# EAGLE design AVRI2CIO_V0_2 (EAGLE 6.3)
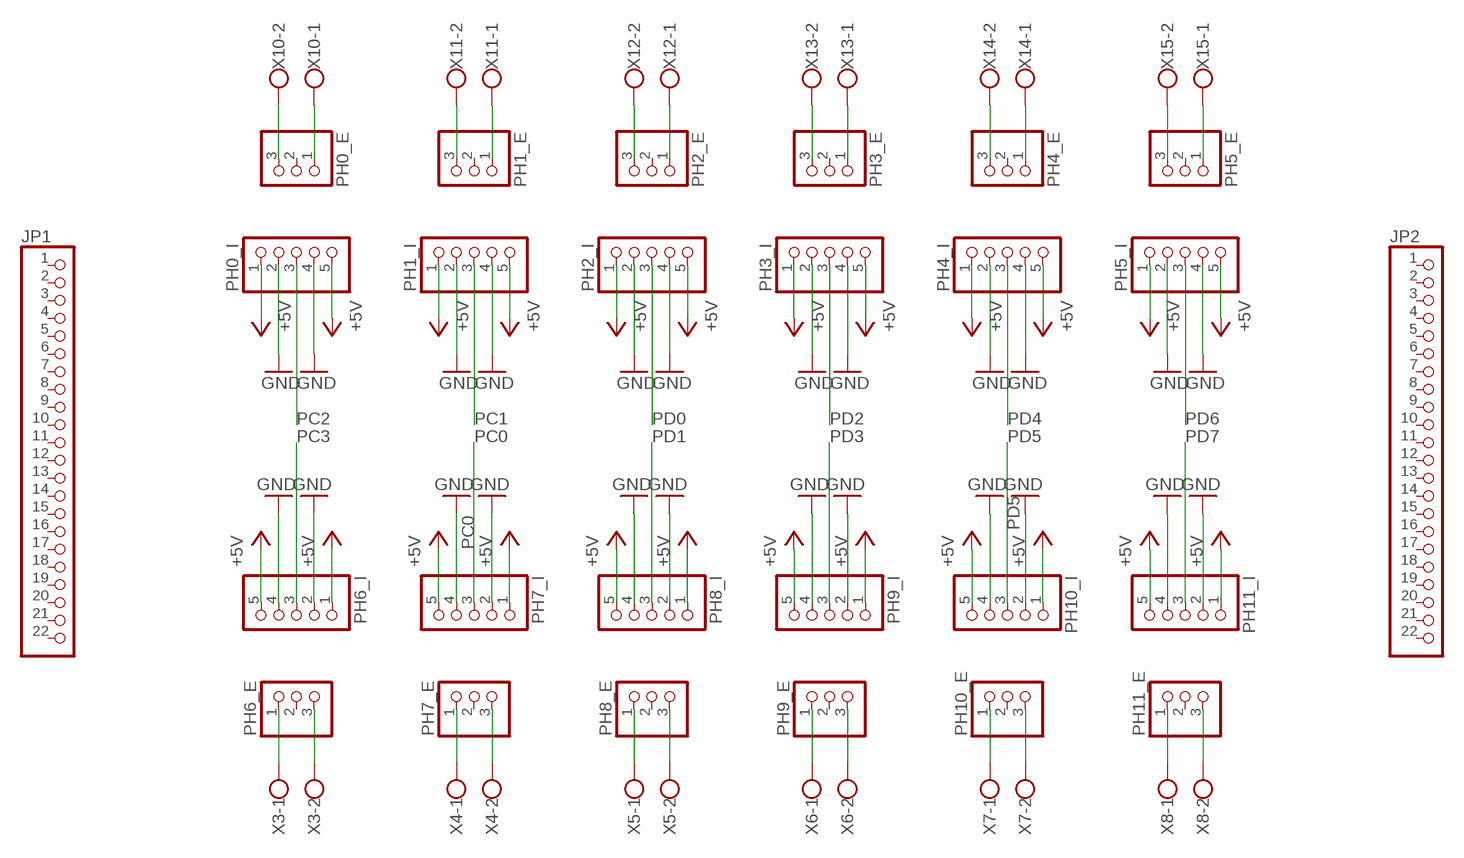
[diagram p0: schematic, sheet 1]

## Parts
JP1  PINHD-1X22  [1X22]
JP2  PINHD-1X22  [1X22]
PH0_E  PINHD-1X3  [1X03]
PH0_I  PINHD-1X5  [1X05]
PH1_E  PINHD-1X3  [1X03]
PH1_I  PINHD-1X5  [1X05]
PH2_E  PINHD-1X3  [1X03]
PH2_I  PINHD-1X5  [1X05]
PH3_E  PINHD-1X3  [1X03]
PH3_I  PINHD-1X5  [1X05]
PH4_E  PINHD-1X3  [1X03]
PH4_I  PINHD-1X5  [1X05]
PH5_E  PINHD-1X3  [1X03]
PH5_I  PINHD-1X5  [1X05]
PH6_E  PINHD-1X3  [1X03]
PH6_I  PINHD-1X5  [1X05]
PH7_E  PINHD-1X3  [1X03]
PH7_I  PINHD-1X5  [1X05]
PH8_E  PINHD-1X3  [1X03]
PH8_I  PINHD-1X5  [1X05]
PH9_E  PINHD-1X3  [1X03]
PH9_I  PINHD-1X5  [1X05]
PH10_E  PINHD-1X3  [1X03]
PH10_I  PINHD-1X5  [1X05]
PH11_E  PINHD-1X3  [1X03]
PH11_I  PINHD-1X5  [1X05]
X3  W237-102  [W237-102]
X4  W237-102  [W237-102]
X5  W237-102  [W237-102]
X6  W237-102  [W237-102]
X7  W237-102  [W237-102]
X8  W237-102  [W237-102]
X10  W237-102  [W237-102]
X11  W237-102  [W237-102]
X12  W237-102  [W237-102]
X13  W237-102  [W237-102]
X14  W237-102  [W237-102]
X15  W237-102  [W237-102]

## Nets
+5V: PH0_I.1 PH0_I.5 PH1_I.1 PH1_I.5 PH2_I.1 PH2_I.5 PH3_I.1 PH3_I.5 PH4_I.1 PH4_I.5 PH5_I.1 PH5_I.5 PH6_I.1 PH6_I.5 PH7_I.1 PH7_I.5 PH8_I.1 PH8_I.5 PH9_I.1 PH9_I.5 PH10_I.1 PH10_I.5 PH11_I.1 PH11_I.5
GND: PH0_I.2 PH0_I.4 PH1_I.2 PH1_I.4 PH2_I.2 PH2_I.4 PH3_I.2 PH3_I.4 PH4_I.2 PH4_I.4 PH5_I.2 PH5_I.4 PH6_I.2 PH6_I.4 PH7_I.2 PH7_I.4 PH8_I.2 PH8_I.4 PH9_I.2 PH9_I.4 PH10_I.2 PH10_I.4 PH11_I.2 PH11_I.4
N$1: PH0_E.3 X10.2
N$2: PH0_E.1 X10.1
N$3: PH6_E.3 X3.2
N$4: PH6_E.1 X3.1
N$5: PH7_E.3 X4.2
N$6: PH7_E.1 X4.1
N$7: PH8_E.3 X5.2
N$8: PH8_E.1 X5.1
N$9: PH9_E.3 X6.2
N$10: PH9_E.1 X6.1
N$11: PH10_E.3 X7.2
N$12: PH10_E.1 X7.1
N$13: PH11_E.3 X8.2
N$14: PH11_E.1 X8.1
N$19: PH1_E.1 X11.1
N$20: PH1_E.3 X11.2
N$23: PH2_E.1 X12.1
N$24: PH2_E.3 X12.2
N$25: PH3_E.1 X13.1
N$26: PH3_E.3 X13.2
N$27: PH4_E.1 X14.1
N$28: PH4_E.3 X14.2
N$29: PH5_E.1 X15.1
N$30: PH5_E.3 X15.2
PC0: PH7_I.3
PC1: PH1_I.3
PC2: PH0_I.3
PC3: PH6_I.3
PD0: PH2_I.3
PD1: PH8_I.3
PD2: PH3_I.3
PD3: PH9_I.3
PD4: PH4_I.3
PD5: PH10_I.3
PD6: PH5_I.3
PD7: PH11_I.3
Unconnected: JP1.1 JP1.2 JP1.3 JP1.4 JP1.5 JP1.6 JP1.7 JP1.8 JP1.9 JP1.10 JP1.11 JP1.12 JP1.13 JP1.14 JP1.15 JP1.16 JP1.17 JP1.18 JP1.19 JP1.20 JP1.21 JP1.22 JP2.1 JP2.2 JP2.3 JP2.4 JP2.5 JP2.6 JP2.7 JP2.8 JP2.9 JP2.10 JP2.11 JP2.12 JP2.13 JP2.14 JP2.15 JP2.16 JP2.17 JP2.18 JP2.19 JP2.20 JP2.21 JP2.22 PH0_E.2 PH1_E.2 PH2_E.2 PH3_E.2 PH4_E.2 PH5_E.2 PH6_E.2 PH7_E.2 PH8_E.2 PH9_E.2 PH10_E.2 PH11_E.2

## Library data of the parts
JP1 JP2 = pinhead:PINHD-1X22: PIN HEADER
PH0_E PH1_E PH2_E PH3_E PH4_E PH5_E PH6_E PH7_E PH8_E PH9_E PH10_E PH11_E = pinhead:PINHD-1X3: PIN HEADER
PH0_I PH1_I PH2_I PH3_I PH4_I PH5_I PH6_I PH7_I PH8_I PH9_I PH10_I PH11_I = pinhead:PINHD-1X5: PIN HEADER
X3-X8 X10-X15 = con-wago-500:W237-102: WAGO SCREW CLAMP; MPN: 237-102; OC_FARNELL: unknown; OC_NEWARK: 70K9898

## Board
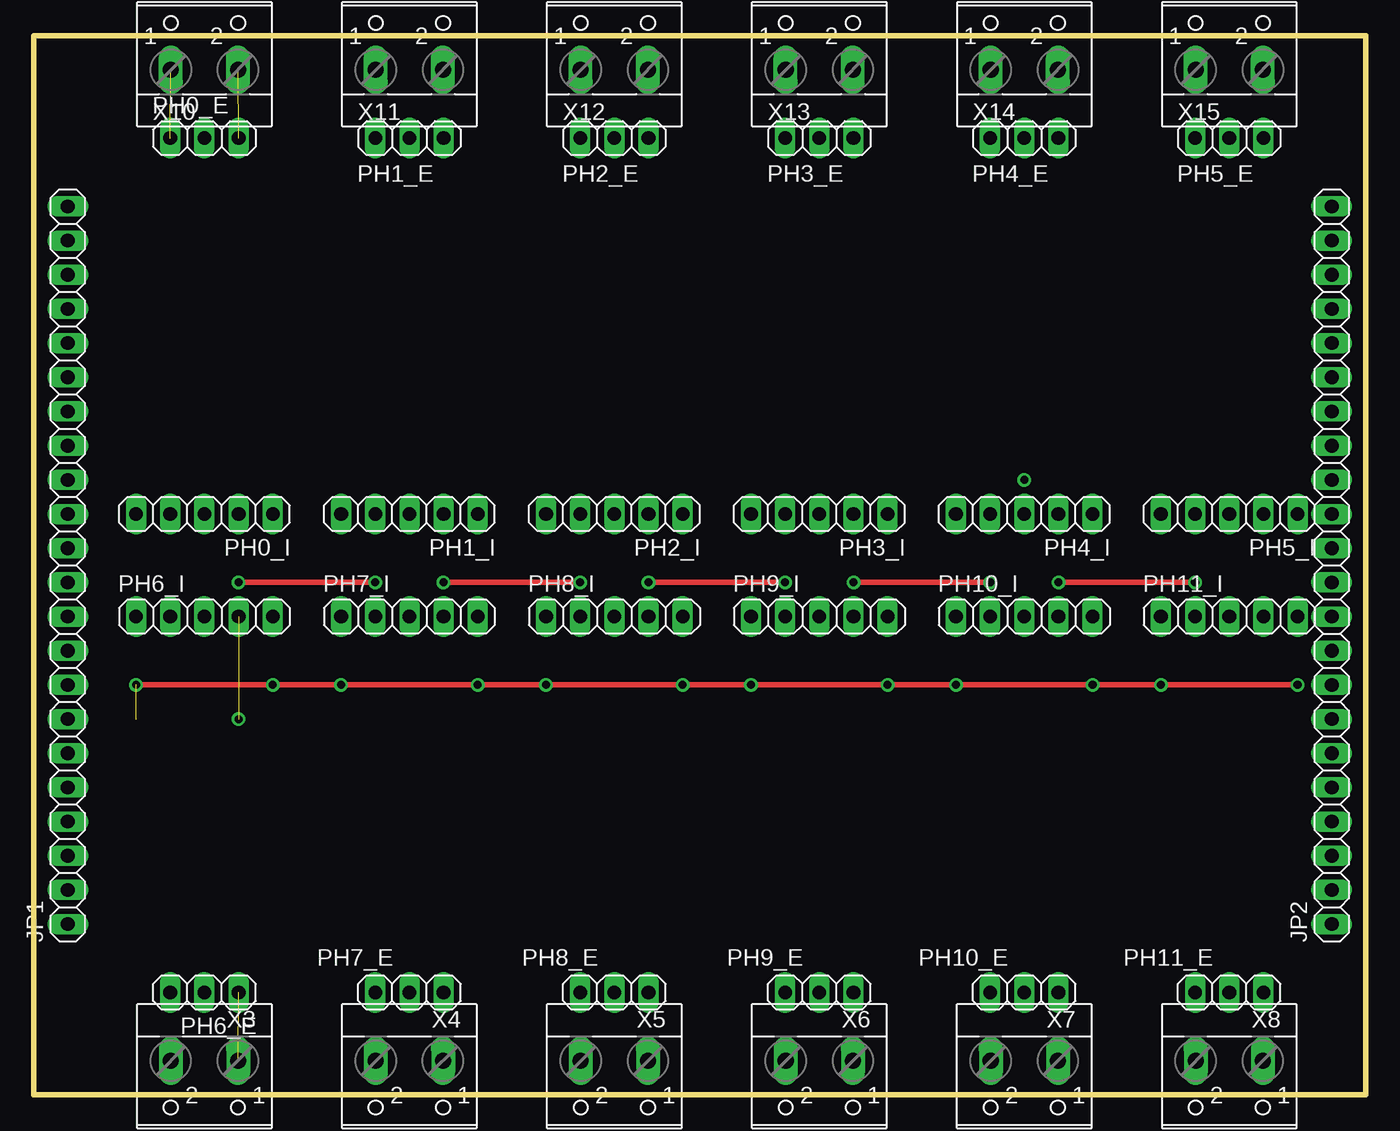
[diagram p1: board, top side]
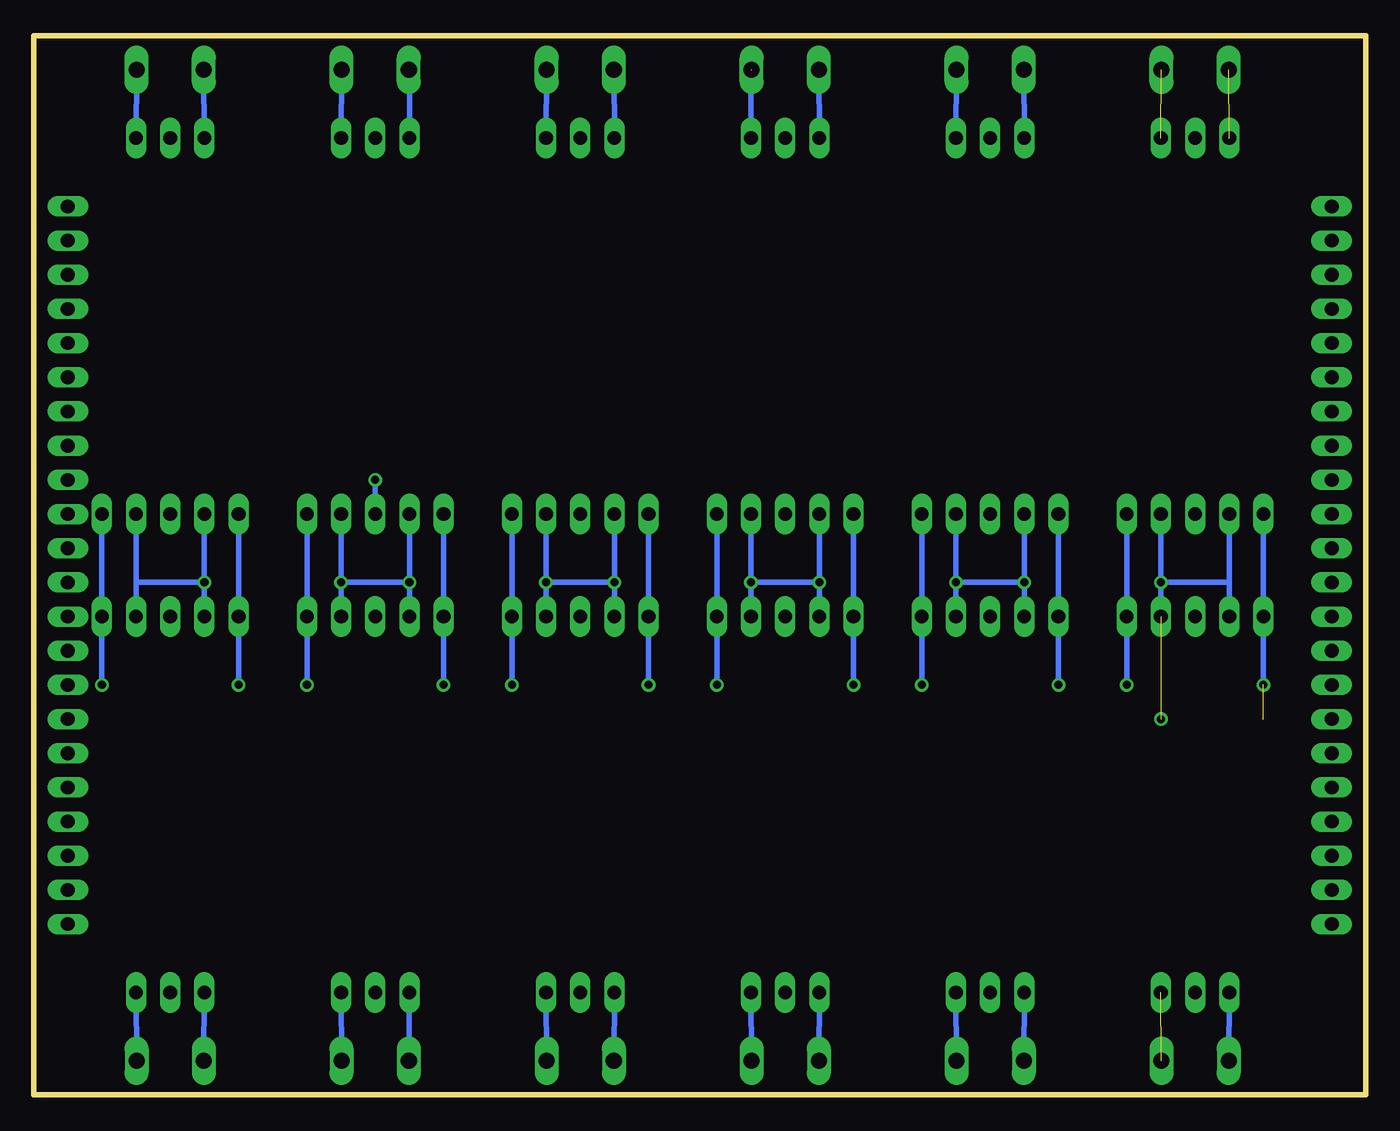
[diagram p2: board, bottom side, seen from below]

Size 99.06 x 78.74 mm. Coordinates in mm from the lower left corner, seen from the top.
Outline: 0,0 99.06,0 99.06,78.74 0,78.74 0,0
Copper layers (1*16): Top 0.035mm / dielectric 1.5mm / Bottom 0.035mm
Design rules "default": minimum track width 10mil, minimum drill 24mil, track to track 8mil, track to pad 8mil, pad to pad 8mil, via to via 8mil, smd to smd 8mil, copper to edge 40mil, drill to drill 8mil, minimum pad ring 10mil, minimum via ring 8mil, stop-mask expansion 4mil, vias tented up to drill 0mil, thermal gap 10mil

### Footprints (pad centres in the part's own frame; a part is rotated, then mirrored left to right if it is on the bottom)
1X22 = drill 1.016 long: 1 -26.67,0; 2 -24.13,0; 3 -21.59,0; 4 -19.05,0; 5 -16.51,0; 6 -13.97,0; 7 -11.43,0; 8 -8.89,0; 9 -6.35,0; 10 -3.81,0; 11 -1.27,0; 12 1.27,0; 13 3.81,0; 14 6.35,0; 15 8.89,0; 16 11.43,0; 17 13.97,0; 18 16.51,0; 19 19.05,0; 20 21.59,0; 21 24.13,0; 22 26.67,0
1X03 = drill 1.016 long: 1 -2.54,0; 2 0,0; 3 2.54,0
1X05 = drill 1.016 long: 1 -5.08,0; 2 -2.54,0; 3 0,0; 4 2.54,0; 5 5.08,0
W237-102 = drill 1.194 long: 1 -2.5,-1.27; 2 2.5,-1.27

### Placement (x,y rotation side)
JP1  2.54,39.37 90 top
JP2  96.52,39.37 90 top
PH0_E  12.7,71.12 0 top
PH0_I  12.7,43.18 180 top
PH1_E  27.94,71.12 0 top
PH1_I  27.94,43.18 180 top
PH2_E  43.18,71.12 0 top
PH2_I  43.18,43.18 180 top
PH3_E  58.42,71.12 0 top
PH3_I  58.42,43.18 180 top
PH4_E  73.66,71.12 0 top
PH4_I  73.66,43.18 180 top
PH5_E  88.9,71.12 0 top
PH5_I  88.9,43.18 180 top
PH6_E  12.7,7.62 180 top
PH6_I  12.7,35.56 0 top
PH7_E  27.94,7.62 180 top
PH7_I  27.94,35.56 0 top
PH8_E  43.18,7.62 180 top
PH8_I  43.18,35.56 0 top
PH9_E  58.42,7.62 180 top
PH9_I  58.42,35.56 0 top
PH10_E  73.66,7.62 180 top
PH10_I  73.66,35.56 0 top
PH11_E  88.9,7.62 180 top
PH11_I  88.9,35.56 0 top
X3  12.7,1.27 180 top
X4  27.94,1.27 180 top
X5  43.18,1.27 180 top
X6  58.42,1.27 180 top
X7  73.66,1.27 180 top
X8  88.9,1.27 180 top
X10  12.7,77.47 0 top
X11  27.94,77.47 0 top
X12  43.18,77.47 0 top
X13  58.42,77.47 0 top
X14  73.66,77.47 0 top
X15  88.9,77.47 0 top

### Tracks (layer width: path | path; a pad name or v marks a point on that pad's centre or on a via)
+5V  (via drill 0.6)  (2 unrouted)
  Top 0.406: v7.62,30.48 v17.78,30.48 v22.86,30.48 v33.02,30.48 v38.1,30.48 v48.26,30.48 v53.34,30.48 v63.5,30.48 v68.58,30.48 v78.74,30.48 v83.82,30.48 v93.98,30.48
  Bottom 0.406: PH9_I.5 63.5,40.64 | PH0_I.5 PH6_I.1 v7.62,30.48 | PH0_I.1 PH6_I.5 v17.78,30.48 | PH9_I.1 PH3_I.5 v53.34,30.48 | PH9_I.5 PH3_I.1 v63.5,30.48 PH9_I.5 | PH10_I.1 PH4_I.5 v68.58,30.48 | PH4_I.1 PH10_I.5 v78.74,30.48 | PH11_I.1 PH5_I.5 v83.82,30.48 | PH5_I.1 PH11_I.5 v93.98,30.48 | PH7_I.1 PH1_I.5 v22.86,30.48 | PH7_I.5 PH1_I.1 v33.02,30.48 | PH2_I.5 PH8_I.1 v38.1,30.48 PH2_I.5 | PH2_I.1 PH8_I.5 v48.26,30.48 PH2_I.1
GND  (via drill 0.6)  (1 unrouted)
  Top 0.406: v15.24,38.1 v25.4,38.1 | v30.48,38.1 v40.64,38.1 | v45.72,38.1 v55.88,38.1 | v60.96,38.1 v71.12,38.1 | v76.2,38.1 v86.36,38.1
  Bottom 0.406: PH0_I.2 v15.24,38.1 | v15.24,38.1 10.16,38.1 | 10.16,38.1 PH6_I.2 | PH1_I.2 v30.48,38.1 | v30.48,38.1 v25.4,38.1 | v25.4,38.1 PH7_I.2 | PH3_I.2 v60.96,38.1 | v60.96,38.1 v55.88,38.1 | v55.88,38.1 PH9_I.2 | PH2_I.2 v45.72,38.1 | v45.72,38.1 v40.64,38.1 | v40.64,38.1 PH8_I.2 | PH4_I.2 v76.2,38.1 | v76.2,38.1 v71.12,38.1 | v71.12,38.1 PH10_I.2 | PH5_I.2 91.44,38.1 | 91.44,38.1 v86.36,38.1 | v86.36,38.1 PH11_I.2 | PH10_I.4 v76.2,38.1 | PH8_I.4 v45.72,38.1 | PH7_I.4 v30.48,38.1 | PH9_I.4 v60.96,38.1 | PH11_I.4 91.44,38.1 | PH5_I.4 v86.36,38.1 | PH3_I.4 v55.88,38.1 | PH2_I.4 v40.64,38.1 | PH1_I.4 v25.4,38.1 | PH0_I.4 10.16,38.1 | PH6_I.4 v15.24,38.1 | PH4_I.4 v71.12,38.1
  other vias: 15.24,27.94
N$1  (1 unrouted)
N$2  (1 unrouted)
N$3
  Bottom 0.406: X3.2 PH6_E.3
N$4  (1 unrouted)
N$5
  Bottom 0.406: X4.2 PH7_E.3
N$6
  Bottom 0.406: X4.1 PH7_E.1
N$7
  Bottom 0.406: X5.2 PH8_E.3
N$8
  Bottom 0.406: X5.1 PH8_E.1
N$9
  Bottom 0.406: X6.2 PH9_E.3
N$10
  Bottom 0.406: X6.1 PH9_E.1
N$11
  Bottom 0.406: X7.2 PH10_E.3
N$12
  Bottom 0.406: X7.1 PH10_E.1
N$13
  Bottom 0.406: X8.2 PH11_E.3
N$14
  Bottom 0.406: X8.1 PH11_E.1
N$19
  Bottom 0.406: PH1_E.1 X11.1
N$20
  Bottom 0.406: PH1_E.3 X11.2
N$23
  Bottom 0.406: PH2_E.1 X12.1
N$24  (1 unrouted)
  Bottom 0.406: PH2_E.3 45.72,76.2
N$25
  Bottom 0.406: PH3_E.1 X13.1
N$26
  Bottom 0.406: PH3_E.3 X13.2
N$27
  Bottom 0.406: PH4_E.1 71.12,76.2 X14.1
N$28
  Bottom 0.406: PH4_E.3 X14.2
N$29
  Bottom 0.406: PH5_E.1 X15.1
N$30
  Bottom 0.406: PH5_E.3 X15.2
PD4  (via drill 0.6)
  Bottom 0.406: PH4_I.3 v73.66,45.72